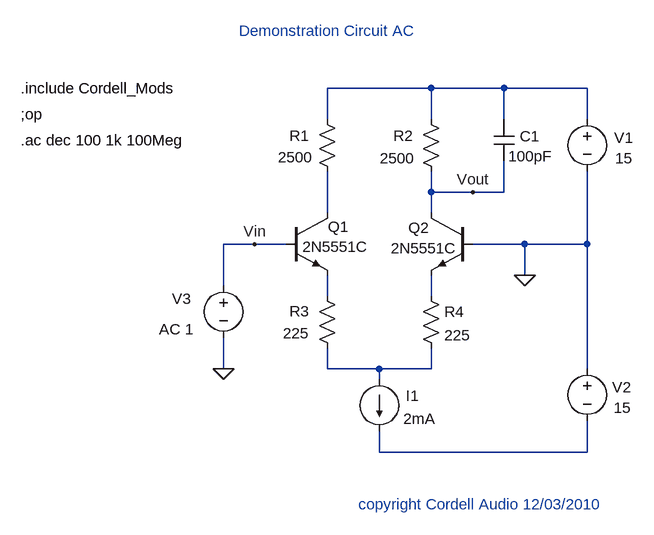
[diagram p0: schematic Demonstration circuit AC.asc]
Demonstration circuit AC.asc, the LTspice schematic file:
Version 4
SHEET 1 880 724
WIRE 160 64 0 64
WIRE 272 64 160 64
WIRE 400 64 272 64
WIRE 0 112 0 64
WIRE 160 112 160 64
WIRE 272 112 272 64
WIRE 400 112 400 64
WIRE 160 224 160 192
WIRE 224 224 160 224
WIRE 272 224 272 176
WIRE 272 224 224 224
WIRE 0 256 0 192
WIRE 160 256 160 224
WIRE -112 304 -160 304
WIRE -64 304 -112 304
WIRE 304 304 224 304
WIRE 400 304 400 192
WIRE 400 304 304 304
WIRE 304 352 304 304
WIRE -160 368 -160 304
WIRE 0 384 0 352
WIRE 160 384 160 352
WIRE -160 496 -160 448
WIRE 0 496 0 464
WIRE 80 496 0 496
WIRE 160 496 160 464
WIRE 160 496 80 496
WIRE 400 496 400 304
WIRE 80 512 80 496
WIRE 80 624 80 592
WIRE 400 624 400 576
WIRE 400 624 80 624
FLAG 304 352 0
FLAG -160 496 0
FLAG -112 304 Vin
FLAG 224 224 Vout
SYMBOL res -16 96 R0
WINDOW 0 -42 41 Left 2
WINDOW 3 -60 74 Left 2
SYMATTR InstName R1
SYMATTR Value 2500
SYMBOL res 144 96 R0
WINDOW 0 -42 41 Left 2
WINDOW 3 -63 76 Left 2
SYMATTR InstName R2
SYMATTR Value 2500
SYMBOL voltage 400 96 R0
WINDOW 123 0 0 Left 2
WINDOW 39 0 0 Left 2
WINDOW 0 42 44 Left 2
WINDOW 3 43 76 Left 2
SYMATTR InstName V1
SYMATTR Value 15
SYMBOL voltage 400 480 R0
WINDOW 123 0 0 Left 2
WINDOW 39 0 0 Left 2
WINDOW 0 39 44 Left 2
WINDOW 3 41 76 Left 2
SYMATTR InstName V2
SYMATTR Value 15
SYMBOL npn -64 256 R0
WINDOW 3 26 52 Left 2
WINDOW 0 65 21 Left 2
SYMATTR Value 2N5551C
SYMATTR InstName Q1
SYMBOL npn 224 256 M0
WINDOW 3 24 54 Left 2
WINDOW 0 67 23 Left 2
SYMATTR Value 2N5551C
SYMATTR InstName Q2
SYMBOL res -16 368 R0
WINDOW 0 -42 39 Left 2
WINDOW 3 -52 73 Left 2
SYMATTR InstName R3
SYMATTR Value 225
SYMBOL res 144 368 R0
SYMATTR InstName R4
SYMATTR Value 225
SYMBOL current 80 512 R0
WINDOW 123 0 0 Left 2
WINDOW 39 0 0 Left 2
WINDOW 0 41 25 Left 2
WINDOW 3 37 61 Left 2
SYMATTR InstName I1
SYMATTR Value 2mA
SYMBOL voltage -160 352 R0
WINDOW 3 -181 172 Left 2
WINDOW 123 -99 83 Left 2
WINDOW 39 0 0 Left 2
WINDOW 0 -79 36 Left 2
SYMATTR Value ""
SYMATTR Value2 AC 1
SYMATTR InstName V3
SYMBOL cap 256 112 R0
WINDOW 3 23 57 Left 2
WINDOW 0 40 26 Left 2
SYMATTR Value 100pF
SYMATTR InstName C1
TEXT -472 104 Left 2 !;op
TEXT -136 -24 Left 2 ;Demonstration Circuit AC
TEXT -472 144 Left 2 !.ac dec 100 1k 100Meg
TEXT -472 64 Left 2 !.include Cordell_Mods
TEXT 48 704 Left 2 ;copyright Cordell Audio 12/03/2010

The netlist it stands for:
* Demonstration circuit AC.asc
R1 N001 N002 2500
R2 N001 Vout 2500
V1 N001 0 15
V2 0 N006 15
Q1 N002 Vin N003 0 2N5551C
Q2 Vout 0 N004 0 2N5551C
R3 N003 N005 225
R4 N004 N005 225
I1 N005 N006 2mA
V3 Vin 0 AC 1
C1 N001 Vout 100pF
.model NPN NPN
.model PNP PNP
.lib standard.bjt
;op
* Demonstration Circuit AC
.ac dec 100 1k 100Meg
.include Cordell_Mods
* copyright Cordell Audio 12/03/2010
.backanno
.end